# EAGLE design puncher (EAGLE 5.10)
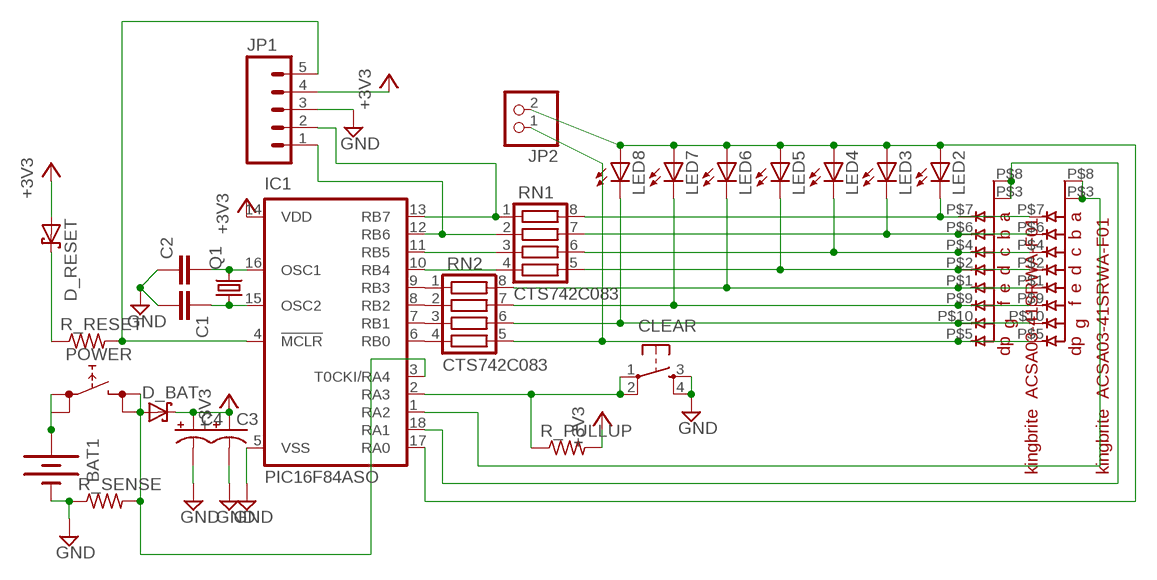
[diagram p0: schematic, sheet 1]

## Parts
BAT1  BATTERY245MM  [BATTCON_245MM]
C1  CAP1206  [1206]
C2  CAP1206  [1206]
C3  CAP_POL7343  [EIA7343]
C4  CAP_POL7343  [EIA7343]
CLEAR  TAC_SWITCHSMD  [TACTILE_SWITCH_SMD]
D_BAT  SCHOTTKY-DIODESMD  [SMB]
D_RESET  SCHOTTKY-DIODESMD  [SMB]
IC1  PIC16F84ASO  [SO-18W]
JP1  M05LOCK  [1X05_LOCK]
JP2  PINHD-1X2  [1X02]
LED2  LEDCHIPLED_1206  [CHIPLED_1206]
LED3  LEDCHIPLED_1206  [CHIPLED_1206]
LED4  LEDCHIPLED_1206  [CHIPLED_1206]
LED5  LEDCHIPLED_1206  [CHIPLED_1206]
LED6  LEDCHIPLED_1206  [CHIPLED_1206]
LED7  LEDCHIPLED_1206  [CHIPLED_1206]
LED8  LEDCHIPLED_1206  [CHIPLED_1206]
POWER  REKN  [REKN]
Q1  CRYSTALTC26V  [TC26V]
R_PULLUP  R-US_M1206  [M1206]
R_RESET  R-US_M1206  [M1206]
R_SENSE  R-US_M1206  [M1206]
RN1  CTS742C083  [CTS742C083]
RN2  CTS742C083  [CTS742C083]
U$1  7SEG_SMTSMT  [7-SEG_SMT]
U$2  7SEG_SMTSMT  [7-SEG_SMT]

## Nets
+3V3: C3.A(+) C4.A(+) D_BAT.C D_RESET.A IC1.14(VDD) JP1.4 R_PULLUP.2
GND: BAT1.2(-) C1.2 C2.1 C3.C(-) C4.C(-) CLEAR.3 CLEAR.4 IC1.5(VSS) JP1.3 R_SENSE.1
N$1: LED2.C RN1.8 U$1.P$7(A) U$2.P$7(A)
N$2: LED3.C RN1.7 U$1.P$6(B) U$2.P$6(B)
N$3: LED4.C RN1.6 U$1.P$4(C) U$2.P$4(C)
N$4: LED5.C RN1.5 U$1.P$2(D) U$2.P$2(D)
N$5: LED6.C RN2.8 U$1.P$1(E) U$2.P$1(E)
N$6: LED8.C RN2.6 U$1.P$10(G) U$2.P$10(G)
N$7: IC1.1(RA2) U$1.P$3(COM_ANODE) U$1.P$8(COM_ANODE)
N$8: C2.2 IC1.16(OSC1) Q1.2
N$9: C1.1 IC1.15(OSC2) Q1.1
N$10: IC1.12(RB6) JP1.1 RN1.2
N$11: IC1.11(RB5) RN1.3
N$12: IC1.10(RB4) RN1.4
N$13: IC1.13(RB7) JP1.2 RN1.1
N$14: IC1.9(RB3) RN2.1
N$15: IC1.8(RB2) RN2.2
N$16: IC1.7(RB1) RN2.3
N$17: LED7.C RN2.7 U$1.P$9(F) U$2.P$9(F)
N$18: D_BAT.A IC1.3(T0CKI/RA4) POWER.1A POWER.1B R_SENSE.2
N$19: IC1.17(RA0) JP2.2 LED2.A LED3.A LED4.A LED5.A LED6.A LED7.A LED8.A
N$20: BAT1.1(+) POWER.0A POWER.0B
N$21: IC1.4(!MCLR) JP1.5 R_RESET.2
N$22: CLEAR.1 CLEAR.2 IC1.2(RA3) R_PULLUP.1
N$23: D_RESET.C R_RESET.1
N$25: IC1.18(RA1) U$2.P$3(COM_ANODE) U$2.P$8(COM_ANODE)
N$26: IC1.6(RB0) RN2.4
N$27: JP2.1 RN2.5 U$1.P$5(DP) U$2.P$5(DP)

## Library data of the parts
BAT1 = SparkFun2011:BATTERY: Battery Holders Various common sizes : AA, AAA, 20mm coin cell and 12mm coin cell.
C1 C2 = SparkFun2011:CAP: Capacitor Standard 0603 ceramic capacitor, and 0.1" leaded capacitor.
C3 C4 = SparkFun2011:CAP_POL: Capacitor Polarized These are standard SMD and PTH capacitors. Normally 10uF, 47uF, and 100uF in electrolytic and tantalum varieties. Always verify the external diameter of the through hole cap, it varies with capacity, voltage, and manufacturer. The EIA devices should be standard.
CLEAR = SparkFun2011:TAC_SWITCH: Momentary Switch Button commonly used for reset or general input. Spark Fun Electronics SKU : COM-00097
D_BAT D_RESET = diode:SCHOTTKY-DIODE: Schottky Diode
IC1 = microchip-5:PIC16F8*: MICROCONTROLLER 8-Bit PIC16F8X Family - CMOS Flash/EEPROM Pin Compatible : PIC16F83, PIC16CR83, PIC16F84A, PIC16CR84 see also PIC16C*
JP1 = SparkFun2011:M05: Header 5 Standard 5-pin 0.1" header. Use with straight break away headers (SKU : PRT-00116), right angle break away headers (PRT-00553), swiss pins (PRT-00743), machine pins (PRT-00117), and female headers (PRT-00115). Molex polarized connector foot print use with SKU : PRT-08230 with associated crimp pins and housings.
JP2 = pinhead:PINHD-1X2: PIN HEADER
LED2-LED8 = led:LED: LED OSRAM: - CHIPLED LG R971, LG N971, LY N971, LG Q971, LY Q971, LO R971, LY R971 LH N974, LH R974 LS Q976, LO Q976, LY Q976 LO Q996 - Hyper CHIPLED LW Q18S LB Q993, LB Q99A, LB R99A - SideLED LS A670, LO A670, LY A670, LG A670, LP A670 LB A673, LV A673, LT A673, LW A673 LH A674 LY A675 LS A676, LA A676, LO A676, LY A676, LW A676 LS A679, LY A679, LG A679 - Hyper Micro SIDELED® LS Y876, LA Y876, LO Y876, LY Y876 LT Y87S - SmartLED LW L88C, LW L88S LB L89C, LB L89S, LG L890 LS L89K, LO L89K, LY L89K LS L896, LA L896, LO L896, LY L896 - TOPLED LS T670, LO T670, LY T670, LG T670, LP T670 LSG T670, LSP T670, LSY T670, LOP T670, LYG T670 LG T671, LOG T671, LSG T671 LB T673, LV T673, LT T673, LW T673 LH T674 LS T676, LA T676, LO T676, LY T676, LB T676, LH T676, LSB T676, LW T676 LB T67C, LV T67C, LT T67C, LS T67K, LO T67K, LY T67K, LW E67C LS E67B, LA E67B, LO E67B, LY E67B, LB E67C, LV E67C, LT E67C LW T67C LS T679, LY T679, LG T679 LS T770, LO T770, LY T770, LG T770, LP T770 LB T773, LV T773, LT T773, LW T773 LH T774 LS E675, LA E675, LY E675, LS T675 LS T776, LA T776, LO T776, LY T776, LB T776 LHGB T686 LT T68C, LB T68C - Hyper Mini TOPLED® LB M676 - Mini TOPLED Santana® LG M470 LS M47K, LO M47K, LY M47K Source: http://www.osram.convergy.de LUXEON: - LUMILED® LXK2-PW12-R00, LXK2-PW12-S00, LXK2-PW14-U00, LXK2-PW14-V00 LXK2-PM12-R00, LXK2-PM12-S00, LXK2-PM14-U00 LXK2-PE12-Q00, LXK2-PE12-R00, LXK2-PE12-S00, LXK2-PE14-T00, LXK2-PE14-U00 LXK2-PB12-K00, LXK2-PB12-L00, LXK2-PB12-M00, LXK2-PB14-N00, LXK2-PB14-P00, LXK2-PB14-Q00 LXK2-PR12-L00, LXK2-PR12-M00, LXK2-PR14-Q00, LXK2-PR14-R00 LXK2-PD12-Q00, LXK2-PD12-R00, LXK2-PD12-S00 LXK2-PH12-R00, LXK2-PH12-S00 LXK2-PL12-P00, LXK2-PL12-Q00, LXK2-PL12-R00 Source: www.luxeon.com KINGBRIGHT: KA-3528ASYC Source: www.kingbright.com
POWER = switch:REKN: PUSH SWITCH ITT-Cannon-Cannon
Q1 = crystal:CRYSTAL: CRYSTAL
R_PULLUP R_RESET R_SENSE = resistor:R-US_: RESISTOR, American symbol
RN1 RN2 = resistor-net:CTS742C083: Chip Resistor Array 4 Single Resistor Source: http://www.ctscorp.com/components/Datasheets/CTSChipArrayDs.pdf
U$1 U$2 = RaphaelBigLibrary:7SEG_SMT

## Net classes
0 default: width 0.254 mm, drill 0.635 mm, clearance 0.254 mm

## Board
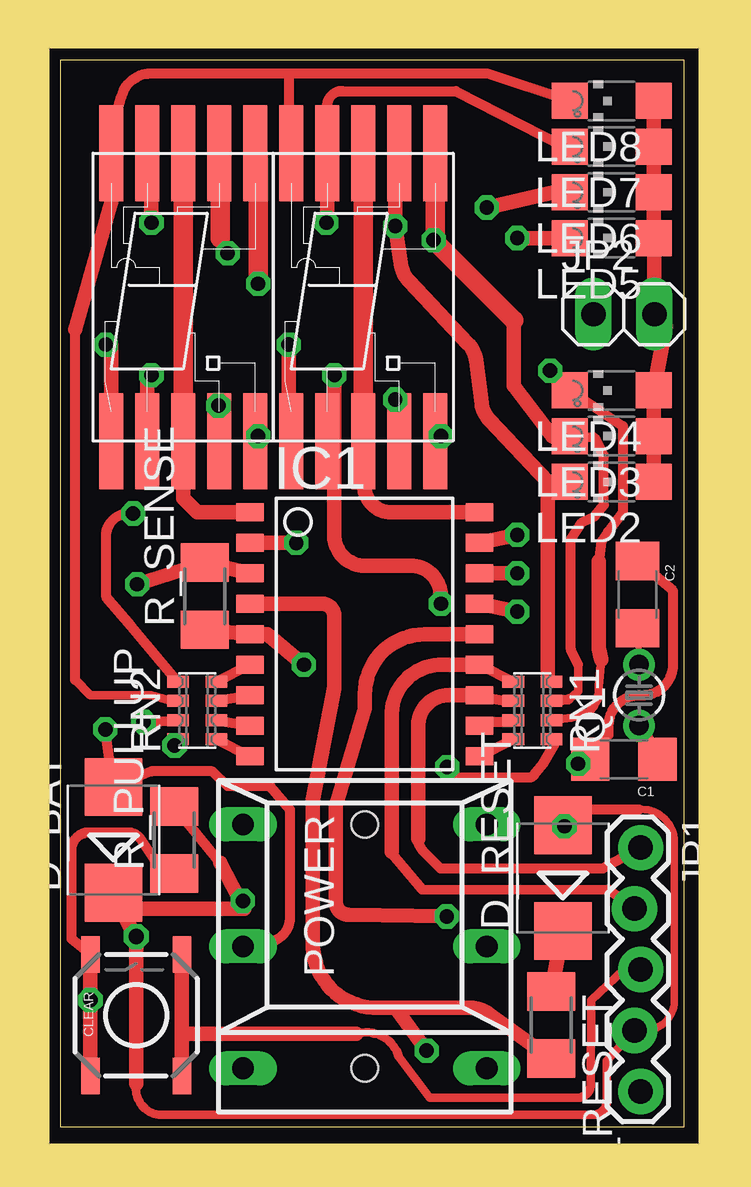
[diagram p1: board, top side]
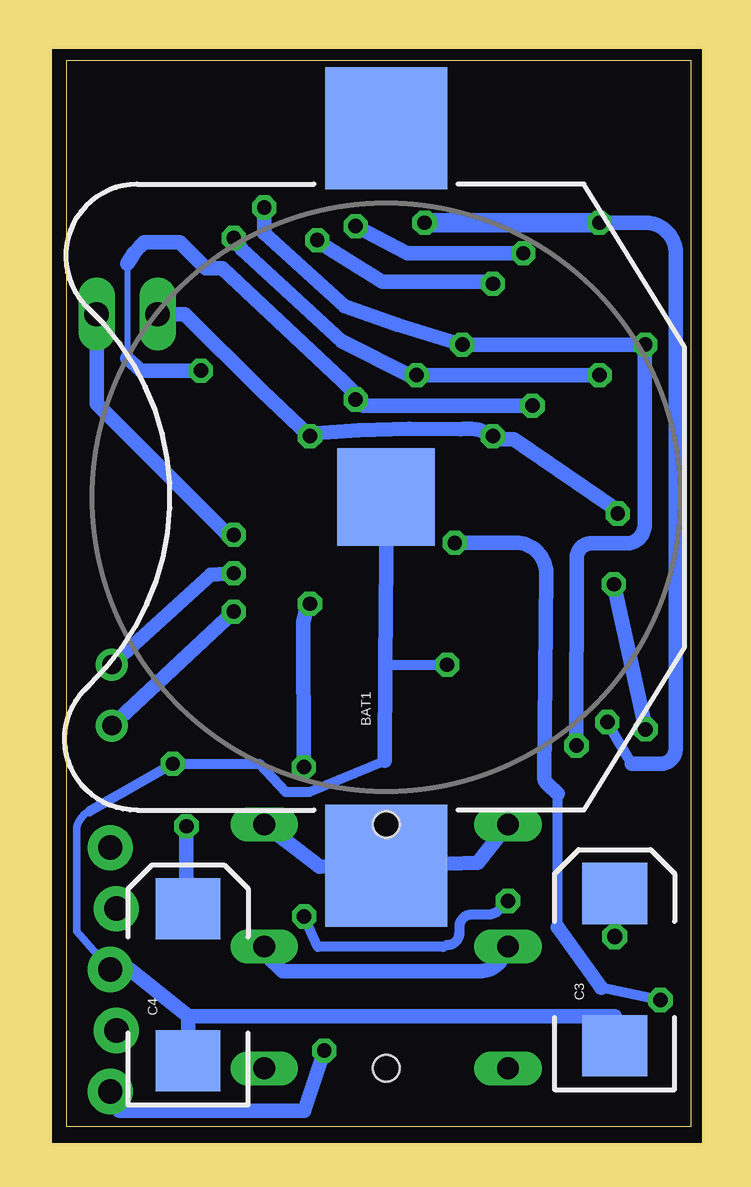
[diagram p2: board, bottom side, seen from below]

Size 26.02 x 44.44 mm. Coordinates in mm from the lower left corner, seen from the top.
Outline: 0,0 26.02,0 26.02,44.44 0,44.44 0,0
Copper layers (1*16): Top 0.035mm / dielectric 1.5mm / Bottom 0.035mm
Design rules "default *": minimum track width 7mil, minimum drill 25mil, track to track 10mil, track to pad 10mil, pad to pad 10mil, via to via 10mil, smd to smd 0mil, copper to edge 10mil, drill to drill 8mil, minimum pad ring 10mil, minimum via ring 8mil, stop-mask expansion 4mil, vias tented up to drill 0mil, thermal gap 10mil
Milling: 4 lines

### Footprints (pad centres in the part's own frame; a part is rotated, then mirrored left to right if it is on the bottom)
BATTCON_245MM = smd 5.08 x 5.08: 1 -15.367,0; 3 15.367,0 | smd 4.064 x 4.064: 2 0,0
1206 = smd 1.6 x 1.8: 1 -1.4,0; 2 1.4,0
EIA7343 = smd 2.55 x 2.7: A 3.17,0; C -3.17,0
TACTILE_SWITCH_SMD = smd 1.524 x 0.762: 1 -2.54,1.905; 2 2.54,1.905; 3 -2.54,-1.905; 4 2.54,-1.905
SMB = smd 2.4 x 2.4: A 2.2,0; C -2.2,0
SO-18W = smd 0.762 x 1.143: 1 -5.08,-4.788; 2 -3.81,-4.788; 3 -2.54,-4.788; 4 -1.27,-4.788; 5 0,-4.788; 6 1.27,-4.788; 7 2.54,-4.788; 8 3.81,-4.788; 9 5.08,-4.788; 10 5.08,4.788; 11 3.81,4.788; 12 2.54,4.788; 13 1.27,4.788; 14 0,4.788; 15 -1.27,4.788; 16 -2.54,4.788; 17 -3.81,4.788; 18 -5.08,4.788
1X05_LOCK = drill 1.016 pad 1.88 round: 1 0,0.127; 2 2.54,-0.127; 3 5.08,0.127; 4 7.62,-0.127; 5 10.16,0.127
1X02 = drill 1.016 long: 1 -1.27,0; 2 1.27,0
CHIPLED_1206 = smd 1.5 x 1.5: A 0,-1.75; C 0,1.75
REKN = drill 0.9 long: 0A 5.08,5.08; 0B 5.08,-5.08; 1A 0,5.08; 1B 0,-5.08; A -5.08,5.08; B -5.08,-5.08 | hole 1.1: -5.08,0; 5.08,0
TC26V = drill 0.813 round: 1 -1.27,0; 2 1.27,0
M1206 = smd 1.6 x 2: 1 -1.4,0; 2 1.4,0
CTS742C083 = smd 0.5 x 0.9: 1 -1.2,-0.8; 2 -0.4,-0.8; 3 0.4,-0.8; 4 1.2,-0.8; 5 1.2,0.8; 6 0.4,0.8; 7 -0.4,0.8; 8 -1.2,0.8
7-SEG_SMT = smd 1 x 4: P$1 0.5,-12; P$2 2,-12; P$3 3.5,-12; P$4 5,-12; P$5 6.5,-12; P$6 6.5,0; P$7 5,0; P$8 3.5,0; P$9 2,0; P$10 0.5,0

### Placement (x,y rotation side)
BAT1  12.7,26.23 90 bottom
C1  23.5,15.3 180 top
C2  24.07,22.16 270 top
C3  3.17,6.54 90 bottom
C4  20.95,5.91 90 bottom
CLEAR  3.17,4.64 90 top
D_BAT  2.22,11.94 90 top
D_RESET  20.95,10.35 90 top
IC1  12.7,20.51 270 top
JP1  24.07,11.62 270 top
JP2  23.5,33.85 0 top
LED2  22.99,26.86 90 top
LED3  22.99,28.77 90 top
LED4  22.99,30.67 90 top
LED5  22.99,37.02 90 top
LED6  22.99,38.93 90 top
LED7  22.99,40.83 90 top
LED8  22.99,42.74 90 top
POWER  12.7,7.51 90 top
Q1  24.13,17.97 90 top
R_PULLUP  4.76,11.94 90 top
R_RESET  20.47,4.23 270 top
R_SENSE  6.03,22.1 90 top
RN1  19.68,17.34 270 top
RN2  5.71,17.34 90 top
U$1  1.64,40.56 0 top
U$2  9.13,40.56 0 top

### Tracks (layer width: path | path; a pad name or v marks a point on that pad's centre or on a via)
+3V3  (via drill 0.6, 0.64)
  Top 0.254: v3.17,7.91 3.17,7.81 | D_BAT.C 2.67,8.83 3.17,9.08 | 22.23,13.21 21.47,12.82 | 21.47,12.82 D_RESET.A | 21.47,12.82 v21.02,12.51
  Top 0.305: 24.45,4 arc90 25.59,5.33 25.59,12 arc90 24.12,13.21
  Top 0.356: JP1.4 22.78,2.73 22.78,1.05 arc-90 22.21,0.48 4.12,0.48 arc-90 3.17,1.78
  Top 0.406: 6.68,10.99 R_PULLUP.2 | JP1.4 24.45,4 | 24.12,13.21 22.23,13.21
  Top 0.61: 3.17,1.78 v3.17,7.91 | 3.17,7.81 2.67,8.83 | 7.67,9.08 6.68,10.99 | 3.17,9.08 7.67,9.08 | IC1.14 15.2,20.51 arc90 12.7,18.01 12.7,17.4 11.49,13.34 11.49,9.34 arc90 12,8.83 v16.12,8.75 | 7.67,9.08 v7.62,9.4
  Bottom 0.254: v3.17,7.91 C3.A
  Bottom 0.406: v7.62,9.4 8.01,9.01 arc45 8.45,8.83 9.14,8.83 arc-90 9.65,8.32 9.65,8.06 arc90 10.16,7.56 10.34,7.48 15.54,7.48 16.04,8.59 v16.12,8.75
  Bottom 0.61: C4.A 21.02,10.57 v21.02,12.51
GND  (via drill 0.6)
  Top 0.254: JP1.3 23.5,6.54 | v21.59,15.11 C1.2
  Top 0.356: 12.34,3.86 arc-90 14.12,2.91 15.4,1.2 21.55,1.19 arc80 22.12,1.72 22.13,5.25 23.5,6.54
  Top 0.406: C2.1 25.54,22.31 25.54,19.14 arc-90 24.13,17.97 arc90 22.86,16.7 22.86,16.32 C1.2
  Top 0.61: 5.08,3.86 CLEAR.4 | 5.08,3.86 CLEAR.3 | 12.34,3.86 5.08,3.86 | R_SENSE.1 IC1.5 8.64,20.51 v10.16,19.24
  Bottom 0.305: 25.07,13.13 arc-61 25.59,12.39 25.59,8.13 JP1.3
  Bottom 0.406: 25.07,13.13 v21.59,15.11 17.97,15.11 16.89,13.95 15.89,13.95 12.76,15.24 | 12.73,19.25 v10.16,19.24
  Bottom 0.61: C3.C 3.17,4.6 20.95,4.6 | 20.95,4.6 C4.C | 20.95,4.6 23.37,6.54 JP1.3 | BAT1.2 12.7,23.69 12.73,19.25 12.76,15.24
N$1  (via drill 0.6)
  Top 0.254: 13.97,40.56 U$2.P$7 | 6.67,40.27 U$1.P$7 | RN1.8 20.32,18.7
  Top 0.61: 13.97,40.56 v13.97,37.52 14.23,35.82 arc31 14.55,35.21 17,32.62 arc-36 17.34,31.91 17.56,30.14 arc36 17.9,29.43 20.32,26.86 | v6.99,36.39 6.67,37.02 | 20.32,26.86 LED2.C | 20.32,18.7 20.32,26.86
  Top 0.813: 6.67,37.02 6.67,40.27
  Bottom 0.61: v13.97,37.52 11.82,36.39 v6.99,36.39
N$2  (via drill 0.6)
  Top 0.254: v15.57,36.93 15.63,37 | 8.26,40.44 U$1.P$6
  Top 0.356: 21.59,19.24 21.59,18.14 21.21,17.8
  Top 0.406: LED3.C 22.28,28.69 22.66,27.96 22.66,25.89 22.28,25.43 21.74,25.17 21.29,24.46 21.29,19.88 21.59,19.24 | RN1.7 21.21,17.8
  Top 0.61: LED3.C 20.51,28.77 18.91,30.86 18.91,33.59
  Top 0.813: 15.63,37 U$2.P$6 | v8.26,35.12 8.26,40.44 | 18.91,33.59 v15.57,36.93
  Bottom 0.61: v15.57,36.93 15.57,36.89 12.85,35.19 8.24,35.19 8.33,35.03 v8.26,35.12
N$3  (via drill 0.6)
  Top 0.254: U$2.P$4 13.97,28.55 v13.97,30.29 | v6.6,30.04 6.63,30.04 U$1.P$4
  Top 0.356: RN1.6 21.3,17.03 22.03,17.26 arc45 22.45,18.21 22.45,18.35 22.55,19.46
  Top 0.406: 22.45,23.55 22.55,24.37 22.84,24.79 23.46,25.59 23.46,29.18 LED4.C
  Top 0.61: v20.42,31.5 LED4.C | 22.55,19.46 22.45,19.93 22.45,23.55
  Bottom 0.254: 23.5,35.94 23.5,32
  Bottom 0.61: v6.6,30.04 13.65,30.04 arc-90 13.9,30.29 v13.97,30.29 13.97,30.5 14.53,31.06 19.52,35.75 20.21,35.75 21.3,36.84 22.78,36.84 22.95,36.68 23.19,36.41 23.5,35.94 | v20.42,31.5 22.91,31.5 23.5,32
N$4  (via drill 0.6)
  Top 0.254: 11.43,28.55 U$2.P$2 | v3.81,31.3 3.63,31.3
  Top 0.406: v16.13,14.97 16.34,14.55 19.67,14.55 arc-45 19.75,14.63 20.13,15.11 20.57,15.88 RN1.5
  Top 0.61: v11.43,31.3 11.43,28.55 11.43,24.64 arc90 12.7,23.37 14.61,23.37 arc-90 15.88,22.1 v15.88,21.78 | 3.63,31.3 U$1.P$2 | v19.05,37.02 LED5.C
  Bottom 0.61: v3.81,31.3 v11.43,31.3 11.68,31.3 arc139 11.69,31.28 14.55,32.72 18.72,36.55 v19.05,37.02 | v16.13,14.97 16.14,21 16,21.64 arc45 15.82,21.84 v15.88,21.78
N$5  (via drill 0.6)
  Top 0.254: 9.53,28.55 U$2.P$1 | v1.91,32.58 2.13,32.58
  Top 0.406: RN2.8 v4.77,15.87
  Top 0.61: v9.53,32.58 9.53,28.55 | 2.13,32.58 U$1.P$1 | LED6.C 20.57,38.92 v17.78,38.29
  Bottom 0.61: 1.93,32.58 v9.53,32.58 12.23,33.41 14.41,34.18 17.78,37.21 v17.78,38.29 | v4.77,15.87 4.76,23.69 arc90 4.15,24.3 2.69,24.3 arc-90 1.93,25.06 1.93,32.58 | 1.93,32.58 v1.91,32.58
N$6
  Top 0.254: 1.91,40.56 U$1.P$10 2.13,38.52
  Top 0.356: 0.64,18.61 1.27,17.97 3.81,17.97 4.68,17.72 RN2.6
  Top 0.406: U$2.P$10 9.53,41.19 9.53,43.88 | 9.53,43.88 17.78,43.88 LED8.C | 1.91,40.56 2.56,42.9 arc-77 3.8,43.88 9.53,43.88 | 0.64,18.61 0.64,33.21
  Top 0.61: 0.64,33.21 2.13,38.52
N$7
  Top 0.61: U$1.P$3 5.13,26.17 5.71,25.59 IC1.1
  Top 0.813: U$1.P$3 U$1.P$8
N$8  (via drill 0.6)
  Top 0.254: Q1.2 C2.2
  Top 0.61: IC1.16 v19.05,23.05
  Bottom 0.61: v19.05,23.05 20,23 Q1.2
N$9  (via drill 0.6)
  Top 0.61: Q1.1 C1.1 | IC1.15 v19.05,21.45
  Bottom 0.61: v19.05,21.45 Q1.1
N$10
  Top 0.406: IC1.12 17.83,17.86 18.78,17.69 arc45 RN1.2 | JP1.1 22.62,10.76 15.85,10.76 15.14,11.47 arc-45 14.92,11.99
  Top 0.61: 14.92,11.99 14.92,16.7 arc-90 16.19,17.97 IC1.12
N$11
  Top 0.406: IC1.11 18,16.87 18.88,16.87 arc45 RN1.3
N$12
  Top 0.406: IC1.10 RN1.4
N$13
  Top 0.406: IC1.13 RN1.1 | JP1.2 22.86,9.87 15.09,9.88 13.85,11.37 arc-45 13.82,11.46
  Top 0.61: 13.82,11.46 13.82,17.24 arc-90 15.98,19.24 IC1.13
N$14
  Top 0.406: RN2.1 IC1.9
N$15
  Top 0.406: RN2.2 IC1.8
N$16
  Top 0.406: RN2.3 IC1.7
N$17  (via drill 0.6)
  Top 0.254: 3.81,40.56 U$1.P$9 | v11.1,37.66 11.13,37.66
  Top 0.406: 21.01,40.83 16.5,43.14 11.77,43.14 arc90 11.13,42.57 U$2.P$9 | v3.48,16.85 RN2.7
  Top 0.61: 21.01,40.83 LED7.C | v3.81,37.66 3.81,40.56 | 11.13,37.66 U$2.P$9
  Bottom 0.406: 2.48,15.11 v3.48,16.85
  Bottom 0.61: v3.81,37.66 1.91,37.66 arc90 0.64,36.39 0.64,15.75 arc90 1.27,15.11 2.48,15.11
  Bottom 0.813: v3.81,37.66 v11.1,37.66
N$18  (via drill 0.6)
  Top 0.406: POWER.1A 8.57,7.68 arc90 9.59,8.7 9.59,13.21 8.76,14.19 6.99,14.19 6.35,14.8 3.81,14.8 D_BAT.A v1.89,16.55
  Top 0.61: IC1.3 R_SENSE.2 v3.21,22.59
  Bottom 0.61: POWER.1A 7.96,6.84 arc45 8.86,6.46 17,6.46 17.67,7.12 POWER.1B | v1.89,16.55 v3.21,22.59
N$19  (via drill 0.6)
  Top 0.254: 24.77,36.54 LED5.A
  Top 0.61: LED2.A LED3.A LED4.A 25.25,33.37 JP2.2 24.77,36.54 | LED5.A LED6.A LED7.A LED8.A | IC1.17 v19.05,24.65
  Bottom 0.61: v19.05,24.65 19.3,24.65 24.77,30.11 JP2.2
N$20
  Bottom 0.61: POWER.0A 8.89,10.99 BAT1.1 15.47,10.82 POWER.0B
N$21  (via drill 0.6)
  Top 0.61: 13.97,4.95 17.09,4.95 arc-33 17.78,4.75 R_RESET.2 | 13.97,4.95 13.29,4.95 arc-90 10.54,7.45 10.54,13.59 11.43,18.29 11.43,21.27 arc90 10.92,21.78 IC1.4 | 13.97,4.95 v15.28,3.16
  Bottom 0.61: JP1.5 23.81,0.66 16.1,0.66 v15.28,3.16
N$22  (via drill 0.6)
  Top 0.254: 4.45,10.35 R_PULLUP.1
  Top 0.406: CLEAR.2 0.48,7.81 0.48,11.58 arc-90 1.27,12.26 2.83,12.26 arc-56 3.36,11.97 4.45,10.35
  Top 0.61: CLEAR.2 v1.27,5.27 CLEAR.1 | v9.84,24.32 IC1.2
  Bottom 0.406: v1.27,5.27 3.75,5.78 | 5.54,8.3 5.56,13.86
  Bottom 0.61: 3.75,5.78 5.54,8.3 | 5.56,13.86 5.99,14.27 arc45 6.11,14.55 6.03,23.05 arc-90 7.3,24.32 v9.84,24.32
N$23
  Top 0.61: R_RESET.1 D_RESET.C
N$25
  Top 0.61: U$2.P$3 12.67,26.83 arc89 13.69,25.59 IC1.18
  Top 0.813: U$2.P$3 U$2.P$8
N$26
  Top 0.406: RN2.4 IC1.6
N$27  (via drill 0.6)
  Top 0.254: U$2.P$5 15.88,28.55 v15.88,28.77 | v8.26,28.77 8.13,28.77 U$1.P$5 | U$1.P$5 8.26,28.55 8.26,27.5 8.13,27.5 U$1.P$5
  Top 0.406: RN2.5 2.97,20.85 1.93,22.05 1.93,24.75 arc-90 v3.05,25.54
  Bottom 0.61: JP2.1 21.08,33.85 17.91,30.67 v15.88,28.77 15.94,28.86 arc8 9.62,29.05 arc44 v8.26,28.77 8.13,28.64 7.38,28.64 3.01,25.63 v3.05,25.54